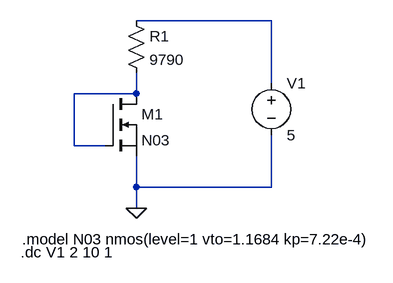
[diagram p0: schematic Practica5.2.asc]
Practica5.2.asc, the LTspice schematic file:
Version 4
SHEET 1 880 680
WIRE 416 16 208 16
WIRE 416 112 416 16
WIRE 208 128 208 96
WIRE 208 128 112 128
WIRE 112 208 112 128
WIRE 160 208 112 208
WIRE 208 272 208 224
WIRE 416 272 416 192
WIRE 416 272 208 272
WIRE 208 304 208 272
FLAG 208 304 0
SYMBOL nmos 160 128 R0
SYMATTR InstName M1
SYMATTR Value N03
SYMBOL res 192 0 R0
SYMATTR InstName R1
SYMATTR Value 9790
SYMBOL voltage 416 96 R0
WINDOW 123 0 0 Left 0
WINDOW 39 0 0 Left 0
SYMATTR InstName V1
SYMATTR Value 5
TEXT 32 352 Left 2 !.model N03 nmos(level=1 vto=1.1684 kp=7.22e-4)
TEXT 30 372 Left 2 !.dc V1 2 10 1

The netlist it stands for:
* Practica5.2.asc
M1 N002 N002 0 0 N03
R1 N001 N002 9790
V1 N001 0 5
.model NMOS NMOS
.model PMOS PMOS
.lib standard.mos
.model N03 nmos(level=1 vto=1.1684 kp=7.22e-4)
.dc V1 2 10 1
.backanno
.end